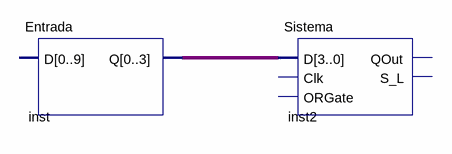
[diagram p0: schematic sheet]
// Quartus schematic ORgate.bdf as structural Verilog: 2 symbols, 0 pins
module ORgate (
);

  wire [3:0] inst_q;

  Entrada inst (.Q(inst_q));  // open: D
  Sistema inst2 (.D(inst_q));  // open: Clk, ORGate, QOut, S_L
endmodule
